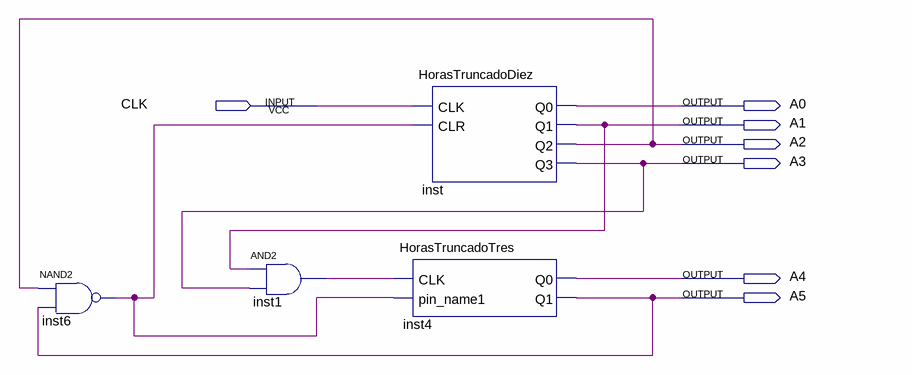
[diagram p0: schematic sheet]
// Quartus schematic RelojHoras.bdf as structural Verilog: 4 symbols, 7 pins
module RelojHoras (
  input  CLK,
  output A0,
  output A1,
  output A2,
  output A3,
  output A4,
  output A5
);

  wire inst1_out, inst6_out;

  nand inst6 (inst6_out, A2, A5);
  and inst1 (inst1_out, A1, A3);
  HorasTruncadoDiez inst (.CLK(CLK), .CLR(inst6_out), .Q0(A0), .Q1(A1), .Q2(A2), .Q3(A3));
  HorasTruncadoTres inst4 (.CLK(inst1_out), .pin_name1(inst6_out), .Q0(A4), .Q1(A5));
endmodule
